# Altium schematic sheet 澳帝T6智能坐便器灯板.SchDoc
size A3
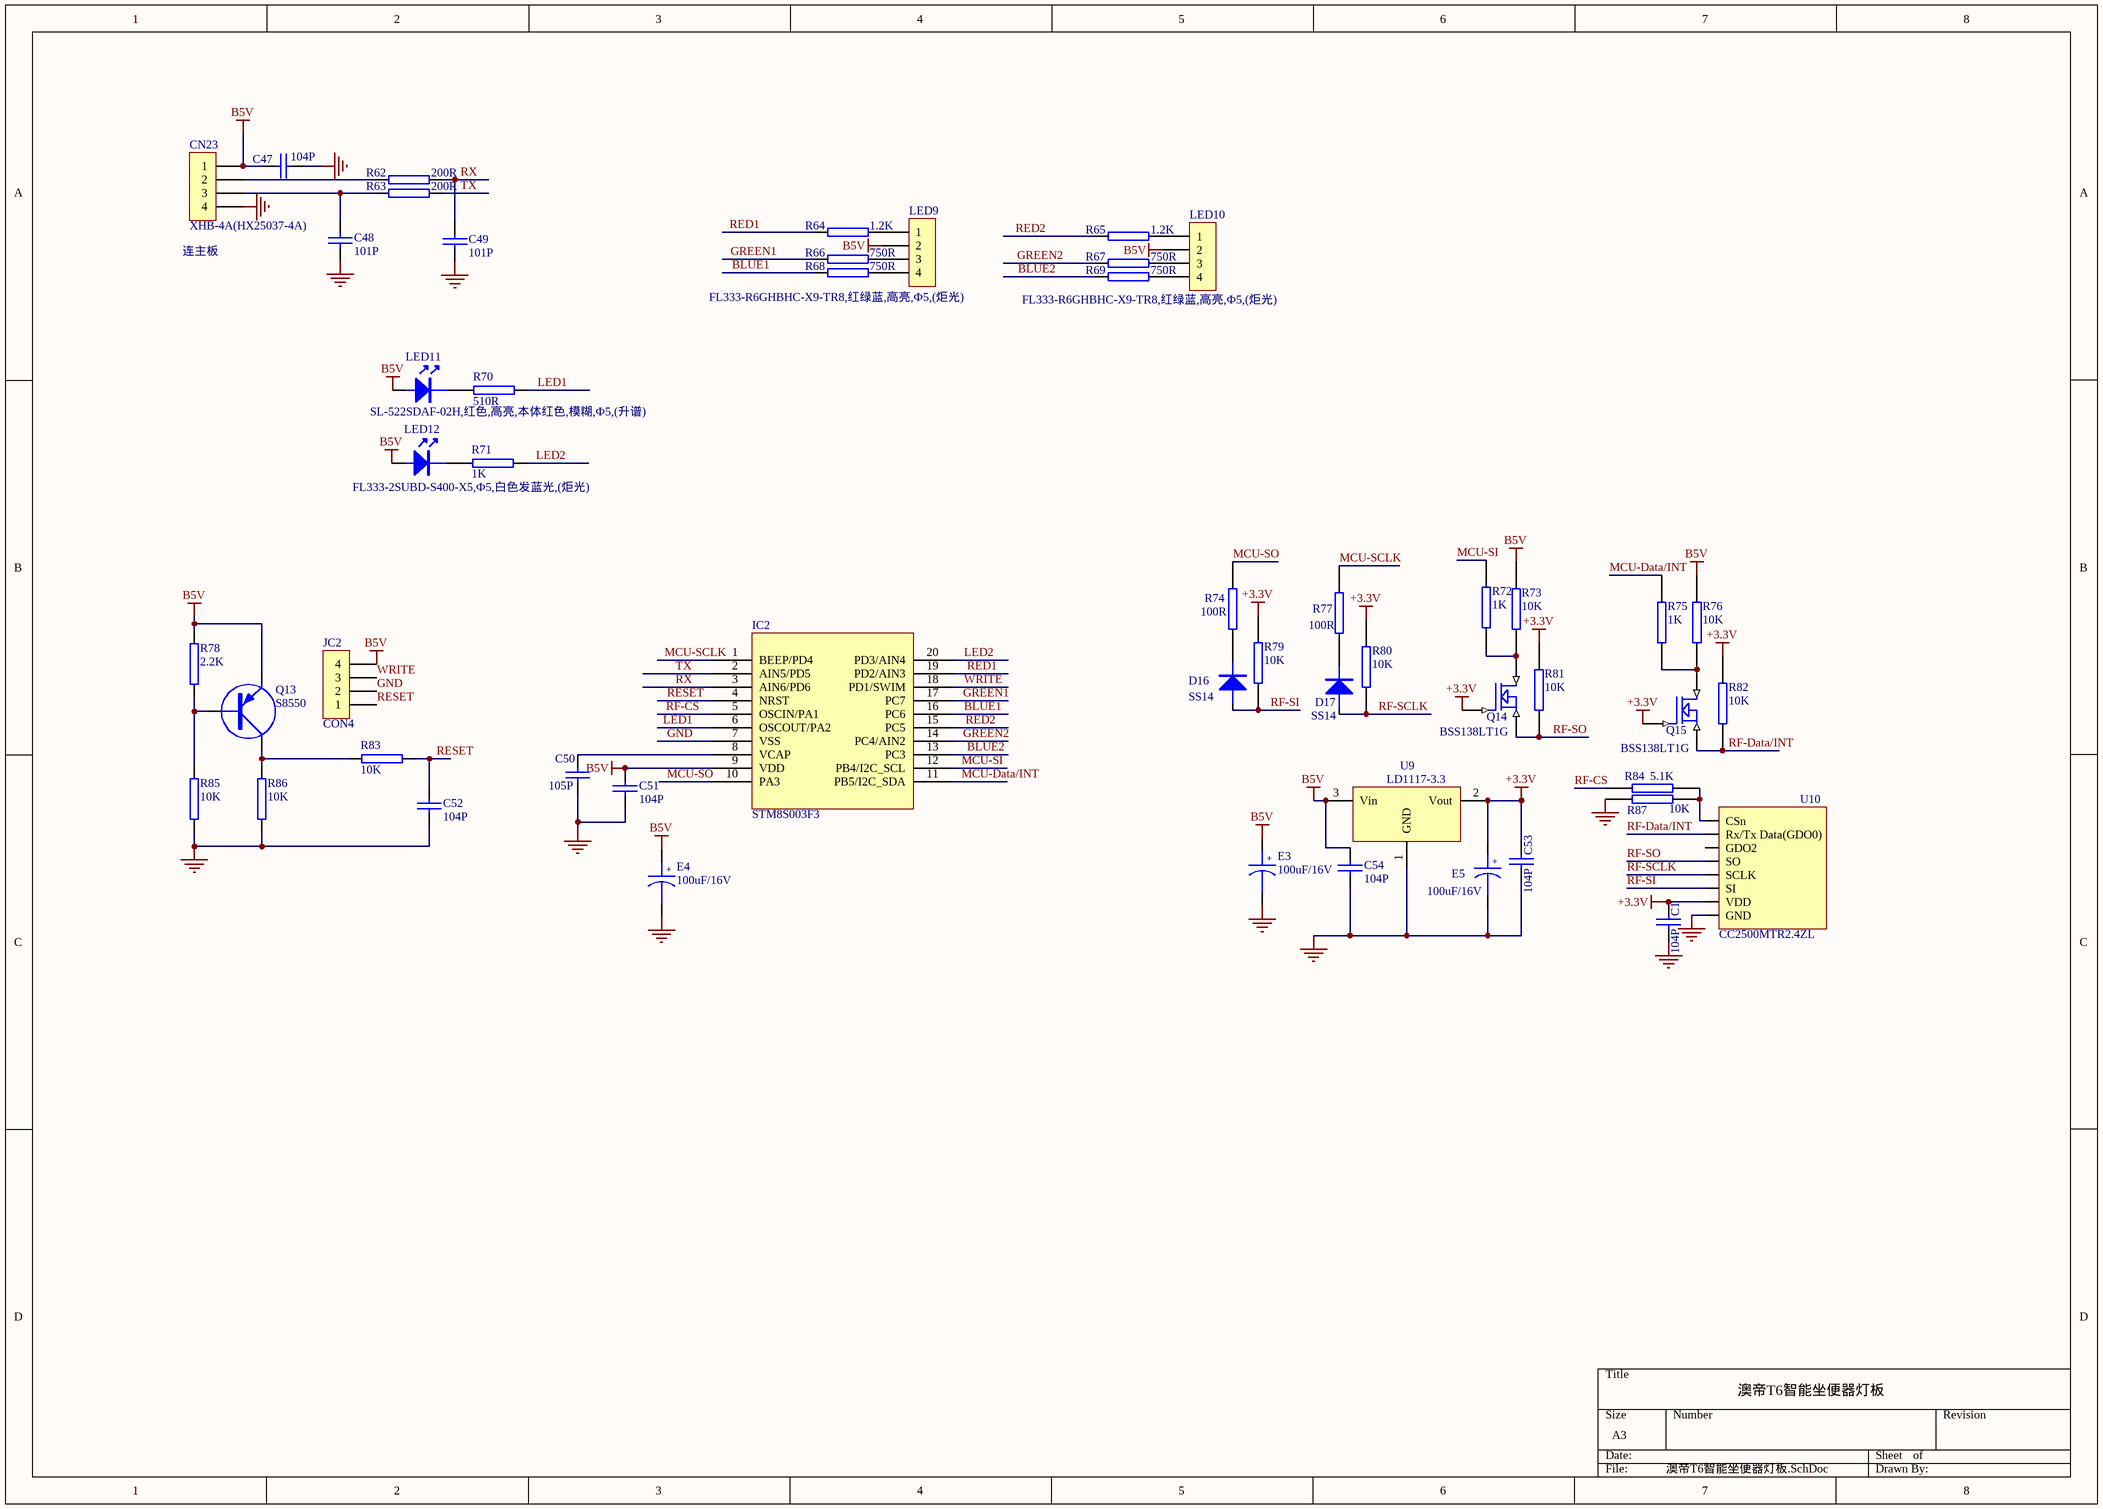
[diagram p0: 澳帝T6智能坐便器灯板.SchDoc]

## Parts
C1  104P  [C0603-T]
C47  104P  [C0603-T]
C48  101P  [C0603-T]
C49  101P  [C0603-T]
C50  105P  [C0603-T]
C51  104P  [C0603-T]
C52  104P  [C0603-T]
C53  104P  [C0603-T]
C54  104P  [C0603-T]
CN23  XHB-4A(HX25037-4A)  [SMW250-04]
D16  SS14  [D-SMA-T]
D17  SS14  [D-SMA-T]
E3  100uF/16V  [E2.5-5-A-SI]
E4  100uF/16V  [E2.5-5-A-SI]
E5  100uF/16V  [E2.5-5-A-SI]
IC2  STM8S003F3  [SOP20-4.5-0.65]
JC2  CON4  [PZ-1*4-M-SI]
LED9  FL333-R6GHBHC-X9-TR8,红绿蓝,高亮,Ф5,(炬光)  [LED-RGB01]
LED10  FL333-R6GHBHC-X9-TR8,红绿蓝,高亮,Ф5,(炬光)  [LED-RGB01]
LED11  SL-522SDAF-02H,红色,高亮,本体红色,模糊,Ф5,(升谱)  [LED-2.5-D5-A]
LED12  FL333-2SUBD-S400-X5,Ф5,白色发蓝光,(炬光)  [LED-2.5-D5-A]
Q13  S8550  [SOT23-123-T]
Q14  BSS138LT1G  [SOT23-123-T]
Q15  BSS138LT1G  [SOT23-123-T]
R62  200R  [R0603-T]
R63  200R  [R0603-T]
R64  1.2K  [R0603-T]
R65  1.2K  [R0603-T]
R66  750R  [R0603-T]
R67  750R  [R0603-T]
R68  750R  [R0603-T]
R69  750R  [R0603-T]
R70  510R  [R0603-T]
R71  1K  [R0603-T]
R72  1K  [R0603-T]
R73  10K  [R0603-T]
R74  100R  [R0603-T]
R75  1K  [R0603-T]
R76  10K  [R0603-T]
R77  100R  [R0603-T]
R78  2.2K  [R0603-T]
R79  10K  [R0603-T]
R80  10K  [R0603-T]
R81  10K  [R0603-T]
R82  10K  [R0603-T]
R83  10K  [R0603-T]
R84  5.1K  [R0603-T]
R85  10K  [R0603-T]
R86  10K  [R0603-T]
R87  10K  [R0603-T]
U9  LD1117-3.3  [SOT223-T]
U10  CC2500MTR2.4ZL  [CC2500MTR2.4ZL]

## Nets
+3.3V: C1.2 C53.2 E5.1 Q14.1(G) Q15.1(G) R79.2 R80.2 R81.2 R82.1 U9.2(Vout) U10.2(VDD)
B5V: C47.2 C51.1 C54.2 CN23.1 E3.1 E4.1 IC2.9(VDD) JC2.4 LED9.2 LED10.2 LED11.A LED12.A Q13.2(E) R73.2 R76.1 R78.2 U9.3(Vin)
GND: C1.1 C47.1 C48.2 C49.2 C50.2 C51.2 C52.1 C53.1 C54.1 CN23.4 E3.2 E4.2 E5.2 IC2.7(VSS) JC2.2 R85.1 R86.1 R87.2 U9.1(GND) U10.1(GND)
BLUE1: IC2.16(PC6) R68.2
BLUE2: IC2.13(PC3) R69.2
GREEN1: IC2.17(PC7) R66.2
GREEN2: IC2.14(PC4/AIN2) R67.2
LED1: IC2.6(OSCOUT/PA2) R70.1
LED2: IC2.20(PD3/AIN4) R71.1
MCU-Data/INT: IC2.11(PB5/I2C_SDA) R75.1
MCU-SCLK: IC2.1(BEEP/PD4) R77.2
MCU-SI: IC2.12(PB4/I2C_SCL) R72.1
MCU-SO: IC2.10(PA3) R74.1
RED1: IC2.19(PD2/AIN3) R64.2
RED2: IC2.15(PC5) R65.2
RESET: C52.2 IC2.4(NRST) JC2.1 R83.1
RF-CS: IC2.5(OSCIN/PA1) R84.2
RF-Data/INT: Q15.2(S) R82.2 U10.7(Rx/Tx_Data(GDO0))
RF-SCLK: D17.A R80.1 U10.4(SCLK)
RF-SI: D16.A R79.1 U10.3(SI)
RF-SO: Q14.2(S) R81.1 U10.5(SO)
RX: C49.1 IC2.3(AIN6/PD6) R62.1
TX: IC2.2(AIN5/PD5) R63.1
WRITE: IC2.18(PD1/SWIM) JC2.3
NetC48_1: C48.1 CN23.3 R63.2
NetC50_1: C50.1 IC2.8(VCAP)
NetCN23_2: CN23.2 R62.2
NetD16_K: D16.K R74.2
NetD17_K: D17.K R77.1
NetLED9_1: LED9.1 R64.1
NetLED9_3: LED9.3 R66.1
NetLED9_4: LED9.4 R68.1
NetLED10_1: LED10.1 R65.1
NetLED10_3: LED10.3 R67.1
NetLED10_4: LED10.4 R69.1
NetLED11_K: LED11.K R70.2
NetLED12_K: LED12.K R71.2
NetQ13_1: Q13.1(B) R78.1 R85.2
NetQ13_3: Q13.3(C) R83.2 R86.2
NetQ14_3: Q14.3(D) R72.2 R73.1
NetQ15_3: Q15.3(D) R75.2 R76.2
NetR84_1: R84.1 R87.1 U10.8(CSn)

Not connected (* = marked no-connect by the designer): U10 6(GDO2)

## Notes on the sheet
- (near CN23) 连主板
- 澳帝T6智能坐便器灯板
- (in symbol CAPACITOR POL) +

## Library data of the parts
C1 C47-C54 = CAP: Capacitor
CN23 JC2 LED9 LED10 = CON4: Connector
D16 D17 = DIODE
E3-E5 = CAPACITOR POL: Capacitor
IC2 = Component_1
LED11 LED12 = DIODE-LED*1
Q13 = PNP: PNP Transistor
Q14 Q15 = MOSFET N
R62-R87 = RES2
U9 = VOLTREG
U10 = 2.4GRF